# EasyEDA schematic OPL4Blaster.json
TITLE: OPL4Blaster; REV: 1.0; Date: 2022-04-25; Sheet: 1/1; Drawn By: OctSL; Company: Your Company
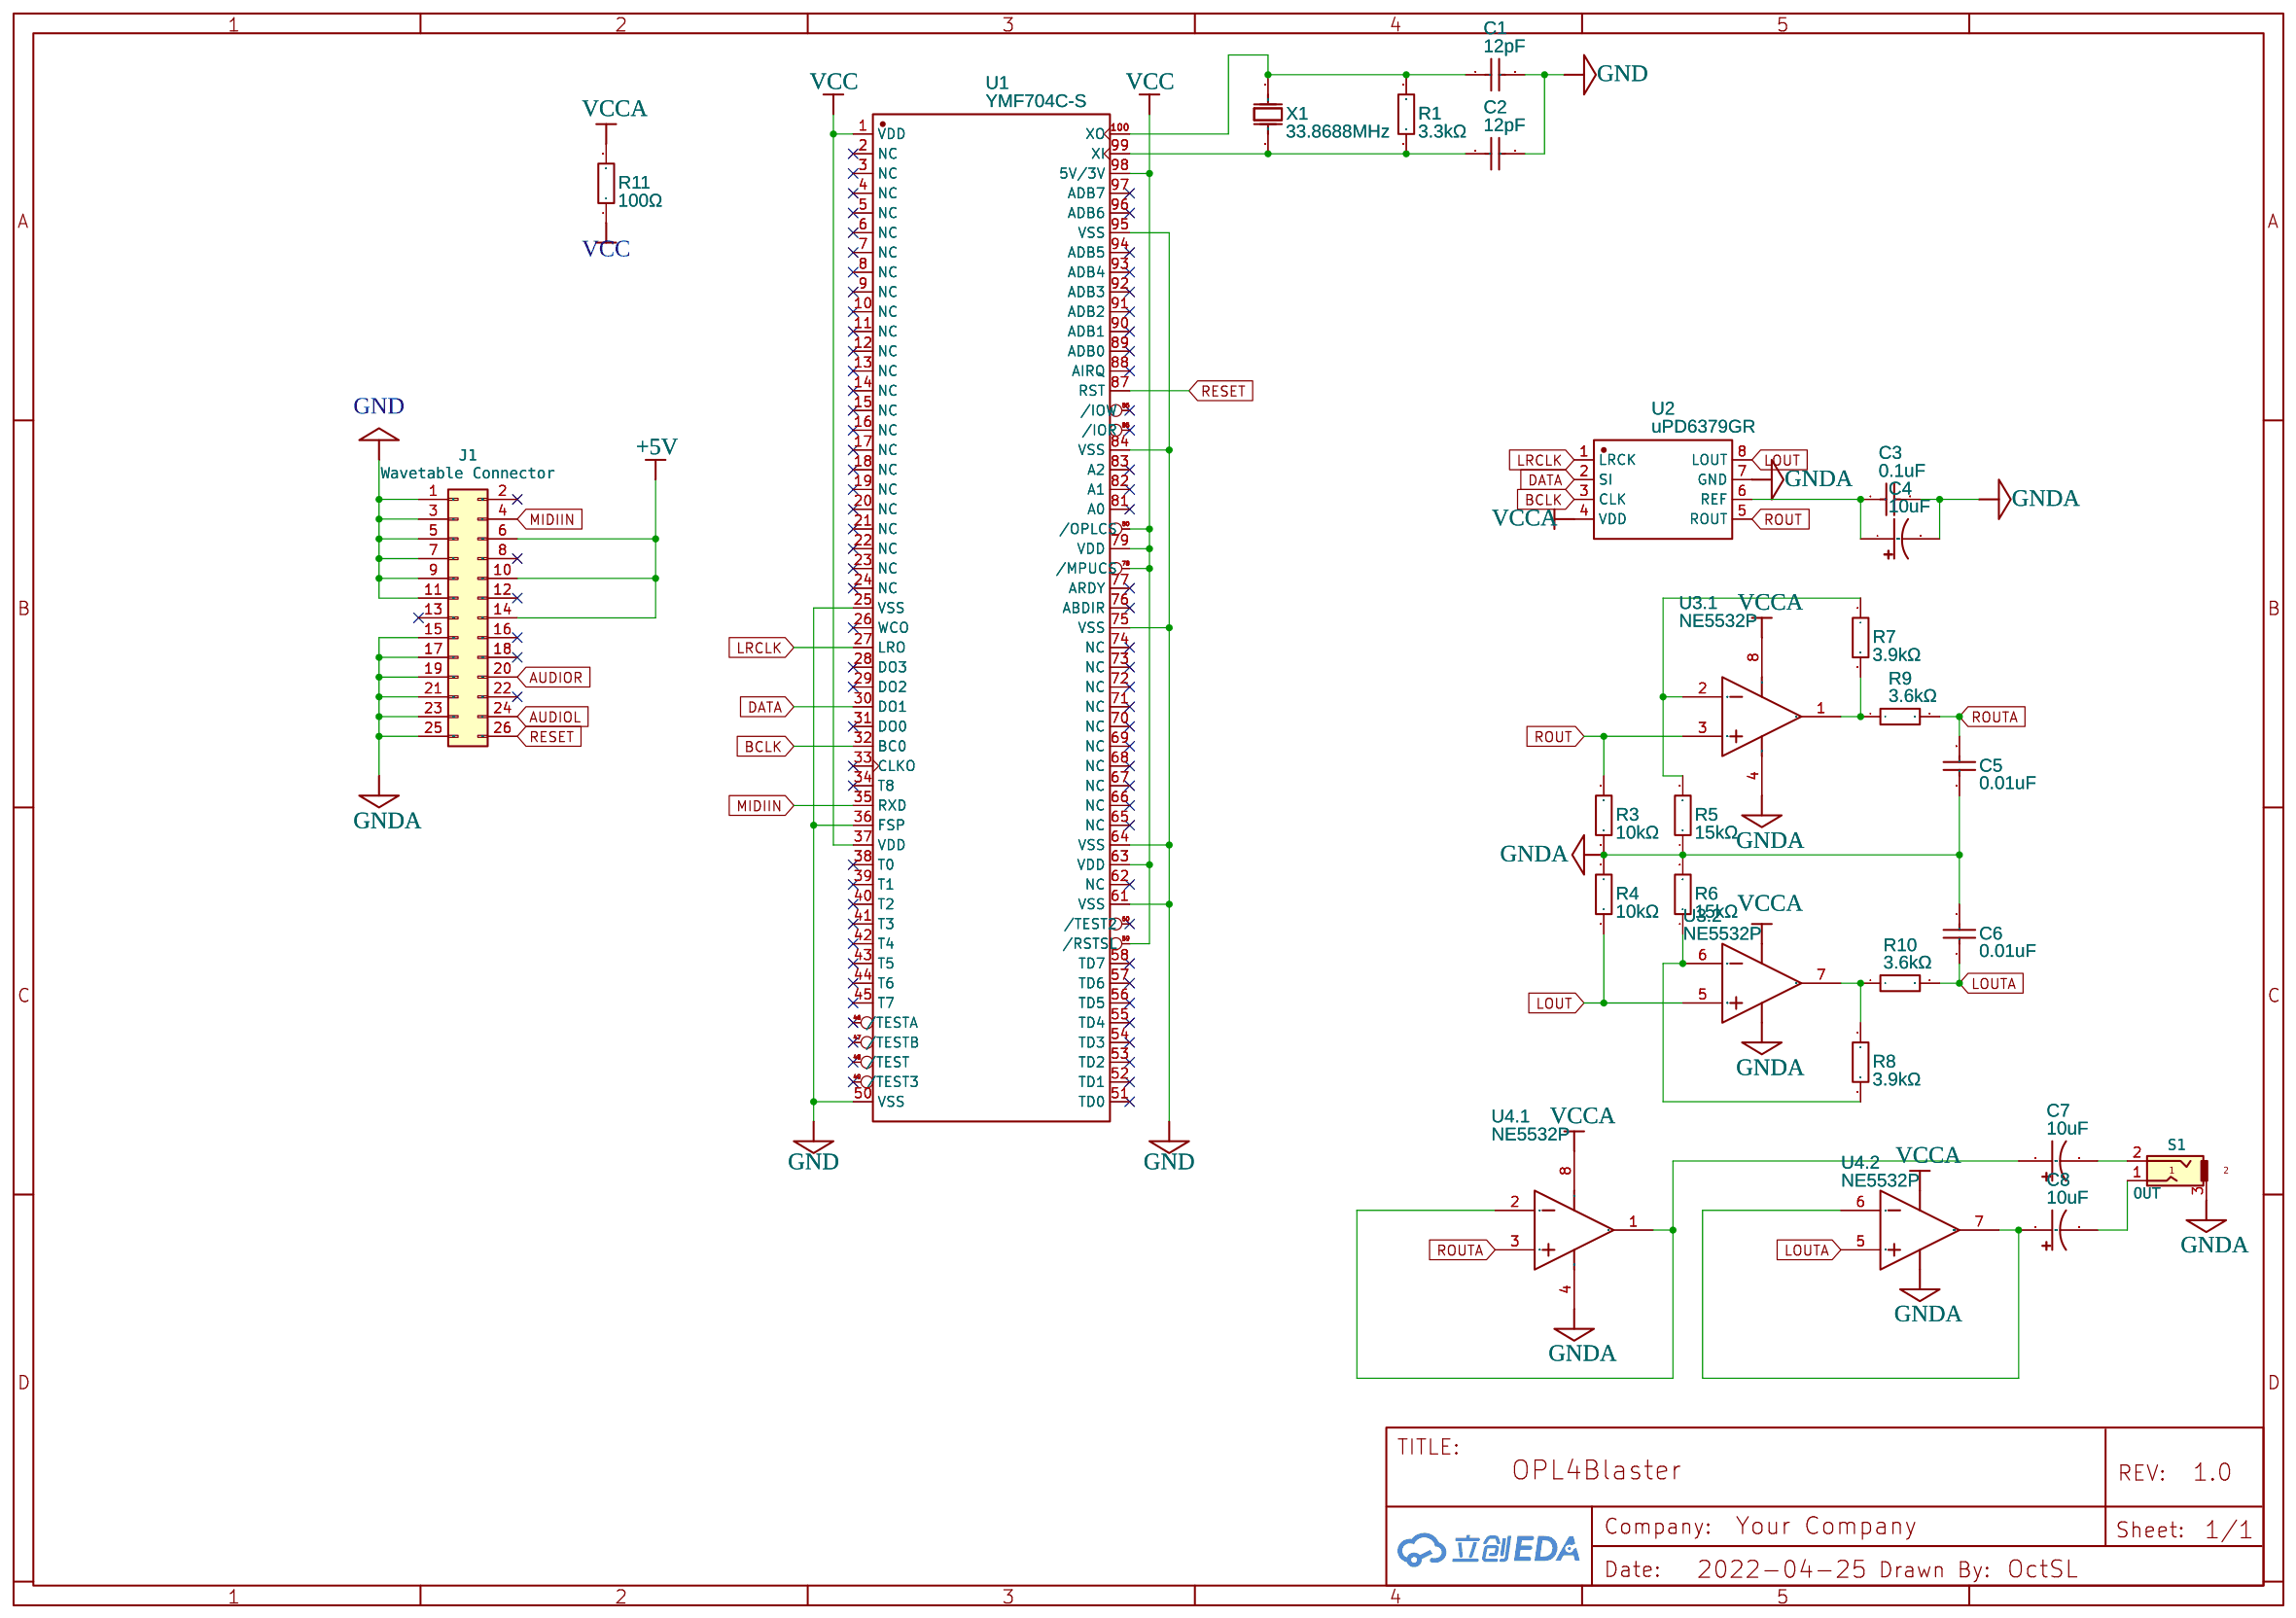
[diagram p0: schematic sheet]

## Parts
C1  12pF  [C0603]
C2  12pF  [C0603]
C3  0.1uF  [C0603]
C4  10uF  [CAP-TH_BD10.0-P5.00-D1.0-FD]
C5  0.01uF  [C0603]
C6  0.01uF  [C0603]
C7  10uF  [CAP-TH_BD10.0-P5.00-D1.0-FD]
C8  10uF  [CAP-TH_BD10.0-P5.00-D1.0-FD]
J1  Wavetable Connector  [PINSOCKET_2X13_P2.54MM_VERTICAL]
R1  3.3kΩ  [R0603]
R3  10kΩ  [R0603]
R4  10kΩ  [R0603]
R5  15kΩ  [R0603]
R6  15kΩ  [R0603]
R7  3.9kΩ  [R0603]
R8  3.9kΩ  [R0603]
R9  3.6kΩ  [R0603]
R10  3.6kΩ  [R0603]
R11  100Ω  [R0603]
S1  OUT  [SB_SJ1-3553]
U1  YMF704C-S  [LQFP-100_L14.0-W14.0-P0.50-LS16.0-BL]
U2  uPD6379GR  [SOIC-8_L5.0-W4.0-P1.27-LS6.0-BL]
U3  NE5532P  [DIP-8_L9.4-W6.4-P2.54-LS9.1-BL]  (sections 1,2)
U4  NE5532P  [DIP-8_L9.4-W6.4-P2.54-LS9.1-BL]  (sections 1,2)
X1  33.8688MHz  [OSC-TH_L10.0-W4.5-P5.00]

## Library data of the parts
C1-C3 C5 C6 = CC0603JRNPO9BN152: Supplier: LCSC; Manufacturer: YAGEO; Supplier Part: C107039; JLCPCB Part Class: Extended Part
C4 C7 C8 = NFA400VB10M10*16_5.0TP: Supplier: LCSC; Supplier Part: C347000; Manufacturer: SamYoung Electronics; Contributor: LCSC; JLCPCB Part Class: Extended Part
R1 R3-R11 = CR0603JA0392G: Supplier: LCSC; Manufacturer: LIZ; Supplier Part: C101341; Resistance (Ohms): 3.9K; JLCPCB Part Class: Extended Part
S1 = -: Mouser: 490-SJ1-3553NG
U1 = YMF704C-S: Supplier: LCSC; Supplier Part: C430092; Manufacturer: YAMAHA; Manufacturer Part: YMF704; Contributor: OctSL; JLCPCB Part Class: Extended Part
U2 = uPD6379GR: Manufacturer: NEC; Contributor: Denjhang
U3 U4 = NE5532P: tags: Audio Operational Amplifier; Supplier Part: C5326; Supplier: LCSC; Manufacturer: TI; subpart_no: 1; image: http://image.lceda.cn/szlcsc/C5326.jpg; JLCPCB Part Class: Extended Part
X1 = X49SD169344MSD2SC: Supplier: LCSC; Manufacturer: ValuePro; Supplier Part: C70703

## Nets
+5V: J1.6(Pin) J1.10(Pin) J1.14(Pin)
GND: C1.2 C2.2 J1.1(Pin) J1.3(Pin) J1.5(Pin) J1.7(Pin) J1.9(Pin) J1.11(Pin) U1.25(VSS) U1.36(FSP) U1.50(VSS) U1.61(VSS) U1.64(VSS) U1.75(VSS) U1.84(VSS) U1.95(VSS)
GNDA: C3.2 C4.2 C5.1 C6.1 J1.15(Pin) J1.17(Pin) J1.19(Pin) J1.21(Pin) J1.23(Pin) J1.25(Pin) R3.1 R4.2 R5.1 R6.2 S1.3 U2.7(GND) U3.4(VCC-) U4.4(VCC-)
VCC: R11.1 U1.1(VDD) U1.37(VDD) U1.59(/RSTSL) U1.63(VDD) U1.78(/MPUCS) U1.79(VDD) U1.80(/OPLCS) U1.98(5V/3V)
VCCA: R11.2 U2.4(VDD) U3.8(VCC+) U4.8(VCC+)
AUDIOL: J1.24(Pin)
AUDIOR: J1.20(Pin)
BCLK: U1.32(BC0) U2.3(CLK)
DATA: U1.30(DO1) U2.2(SI)
LOUT: R4.1 U2.8(LOUT) U3.5(IN2+)
LOUTA: C6.2 R10.2 U4.5(IN2+)
LRCLK: U1.27(LRO) U2.1(LRCK)
MIDIIN: J1.4(Pin) U1.35(RXD)
RESET: J1.26(Pin) U1.87(RST)
ROUT: R3.2 U2.5(ROUT) U3.3(IN1+)
ROUTA: C5.2 R9.2 U4.3(IN1+)
Net-(C1-1): C1.1 R1.2 U1.100(XO) X1.1(OSC1)
Net-(C2-1): C2.1 R1.1 U1.99(XI) X1.2(OSC2)
Net-(C3-1): C3.1 C4.1 U2.6(REF)
Net-(C7-1): C7.1 U4.1(OUT1) U4.2(IN1-)
Net-(C7-2): C7.2 S1.2
Net-(C8-1): C8.1 U4.6(IN2-) U4.7(OUT2)
Net-(C8-2): C8.2 S1.1
Net-(R5-2): R5.2 R7.1 U3.2(IN1-)
Net-(R6-1): R6.1 R8.2 U3.6(IN2-)
Net-(R7-2): R7.2 R9.1 U3.1(OUT1)
Net-(R8-1): R8.1 R10.1 U3.7(OUT2)

Not connected (* = marked no-connect by the designer): J1 2(Pin)* 8(Pin)* 12(Pin)* 13(Pin)* 16(Pin)* 18(Pin)* 22(Pin)*; U1 2(NC)* 3(NC)* 4(NC)* 5(NC)* 6(NC)* 7(NC)* 8(NC)* 9(NC)* 10(NC)* 11(NC)* 12(NC)* 13(NC)* 14(NC)* 15(NC)* 16(NC)* 17(NC)* 18(NC)* 19(NC)* 20(NC)* 21(NC)* 22(NC)* 23(NC)* 24(NC)* 26(WCO)* 28(DO3)* 29(DO2)* 31(DO0)* 33(CLKO)* 34(T8)* 38(T0)* 39(T1)* 40(T2)* 41(T3)* 42(T4)* 43(T5)* 44(T6)* 45(T7)* 46(/TESTA)* 47(/TESTB)* 48(/TEST)* 49(/TEST3)* 51(TD0)* 52(TD1)* 53(TD2)* 54(TD3)* 55(TD4)* 56(TD5)* 57(TD6)* 58(TD7)* 60(/TEST2)* 62(NC)* 65(NC)* 66(NC)* 67(NC)* 68(NC)* 69(NC)* 70(NC)* 71(NC)* 72(NC)* 73(NC)* 74(NC)* 76(ABDIR)* 77(ARDY)* 81(A0)* 82(A1)* 83(A2)* 85(/IOR)* 86(/IOW)* 88(AIRQ)* 89(ADB0)* 90(ADB1)* 91(ADB2)* 92(ADB3)* 93(ADB4)* 94(ADB5)* 96(ADB6)* 97(ADB7)*
